# EAGLE schematic schematic_team_xA (EAGLE 8.5.2)
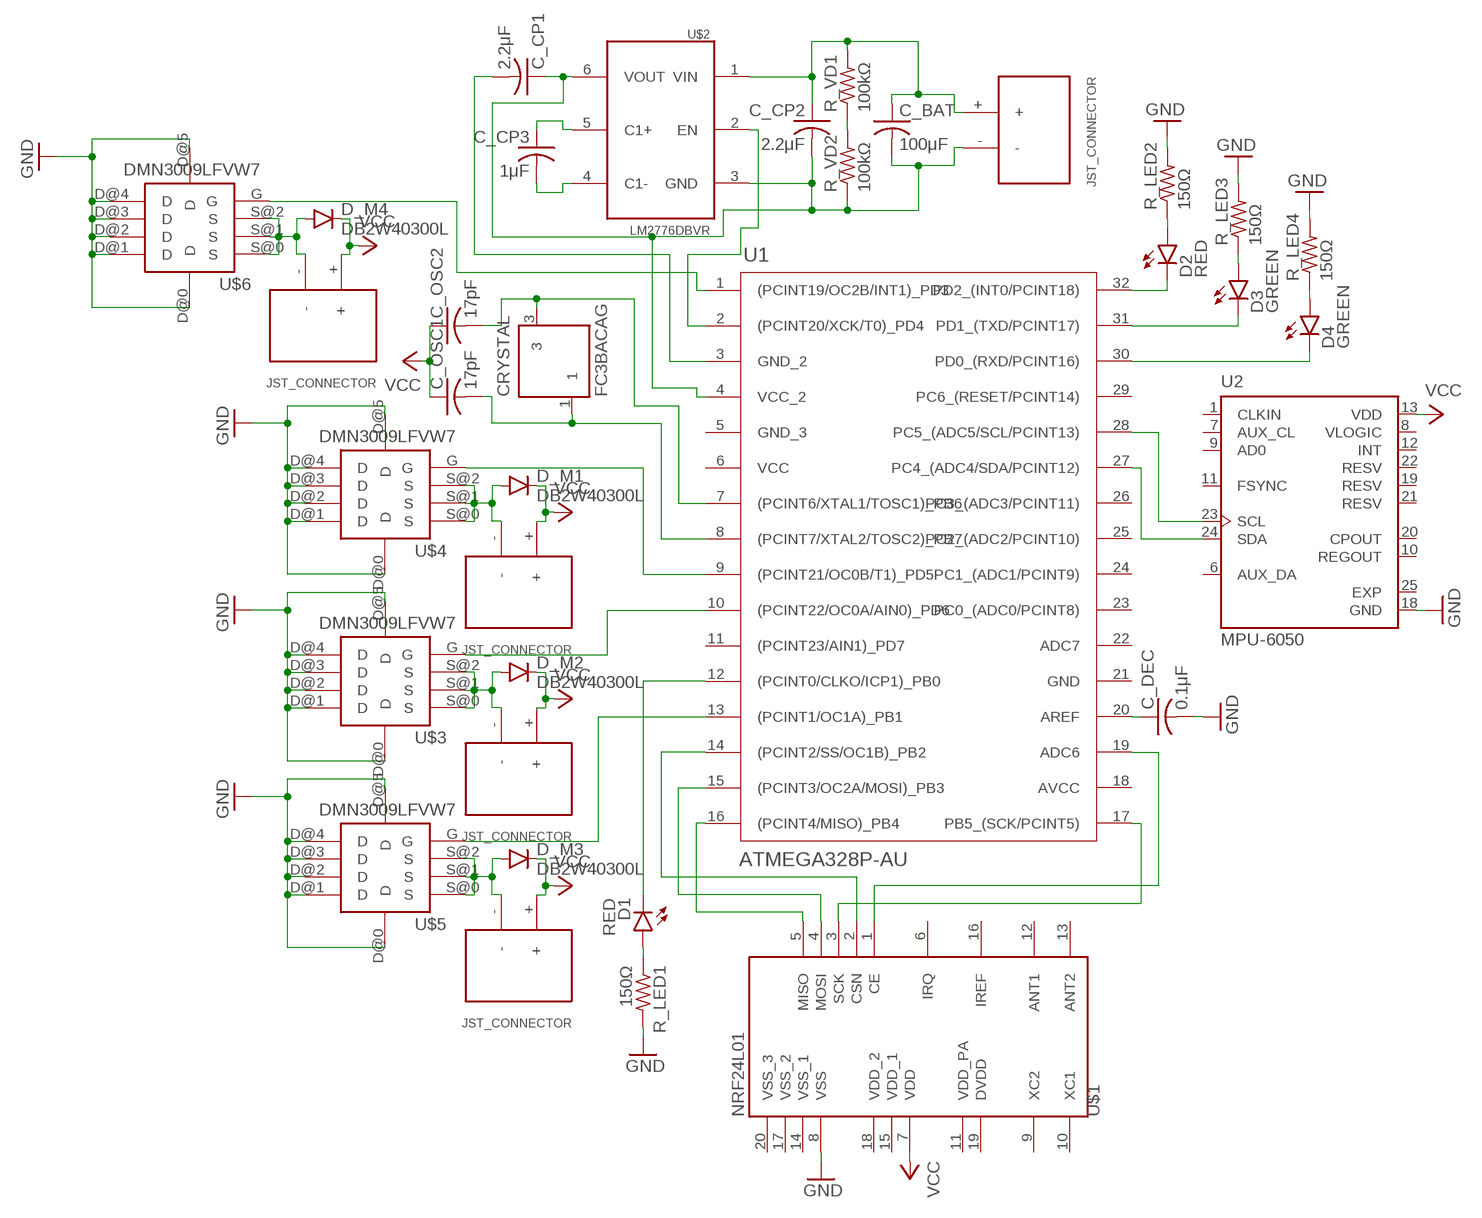
[diagram p0: schematic, sheet 1]

## Parts
C_BAT  100μF  C-USC0805  [C0805]
C_CP1  2.2μF  C-USC0603  [C0603]
C_CP2  2.2μF  C-USC0603  [C0603]
C_CP3  1μF  C-USC0603  [C0603]
C_DEC  0.1μF  C-USC0805  [C0805]
C_OSC1  17pF  C-USC0402  [C0402]
C_OSC2  17pF  C-USC0402  [C0402]
CRYSTAL  FC3BACAG  [SOT23-5]
D1  RED  LED-RED0603  [LED-0603]
D2  RED  LED-RED0603  [LED-0603]
D3  GREEN  LED-GREEN0603  [LED-0603]
D4  GREEN  LED-GREEN0603  [LED-0603]
D_M1  DB2W40300L  [MINI2-F3-B]
D_M2  DB2W40300L  [MINI2-F3-B]
D_M3  DB2W40300L  [MINI2-F3-B]
D_M4  DB2W40300L  [MINI2-F3-B]
MOTOR1  JST_CONNECTOR_FEMALE  [JST_CONNECTOR_FEMALE]
MOTOR2  JST_CONNECTOR_FEMALE  [JST_CONNECTOR_FEMALE]
MOTOR3  JST_CONNECTOR_FEMALE  [JST_CONNECTOR_FEMALE]
MOTOR4  JST_CONNECTOR_FEMALE  [JST_CONNECTOR_FEMALE]
MOTOR5  JST_CONNECTOR_FEMALE  [JST_CONNECTOR_FEMALE]
R_LED1  150Ω  R-US_R0603  [R0603]
R_LED2  150Ω  R-US_R0603  [R0603]
R_LED3  150Ω  R-US_R0603  [R0603]
R_LED4  150Ω  R-US_R0603  [R0603]
R_VD1  100kΩ  R-US_R0603  [R0603]
R_VD2  100kΩ  R-US_R0603  [R0603]
U1  ATMEGA328P-AU  [32A]
U2  MPU-6050  [QFN50P400X400X95-25N]
U$1  NRF24L01  [QFN20]
U$2  LM2776DBVR  [SOT23-5]
U$3  DMN3009LFVW7  [SOT23-5]
U$4  DMN3009LFVW7  [SOT23-5]
U$5  DMN3009LFVW7  [SOT23-5]
U$6  DMN3009LFVW7  [SOT23-5]

## Nets
GND: C_DEC.2 R_LED1.2 R_LED2.2 R_LED3.2 R_LED4.2 U2.18(GND) U$1.8(VSS) U$3.D@0(D) U$3.D@1(D) U$3.D@2(D) U$3.D@3(D) U$3.D@4(D) U$3.D@5(D) U$4.D@0(D) U$4.D@1(D) U$4.D@2(D) U$4.D@3(D) U$4.D@4(D) U$4.D@5(D) U$5.D@0(D) U$5.D@1(D) U$5.D@2(D) U$5.D@3(D) U$5.D@4(D) U$5.D@5(D) U$6.D@0(D) U$6.D@1(D) U$6.D@2(D) U$6.D@3(D) U$6.D@4(D) U$6.D@5(D)
N$1: U1.28(PC5_(ADC5/SCL/PCINT13)) U2.23(SCL)
N$2: C_OSC1.2 CRYSTAL.1 U1.8((PCINT7/XTAL2/TOSC2)_PB7)
N$3: U1.10((PCINT22/OC0A/AIN0)_PD6) U$3.G
N$4: C_DEC.1 U1.20(AREF)
N$5: D_M4.POS(PPIN) MOTOR4.- U$6.S@0(S) U$6.S@1(S) U$6.S@2(S)
N$6: D_M2.POS(PPIN) MOTOR2.- U$3.S@0(S) U$3.S@1(S) U$3.S@2(S)
N$7: U1.27(PC4_(ADC4/SDA/PCINT12)) U2.24(SDA)
N$8: U1.1((PCINT19/OC2B/INT1)_PD3) U$6.G
N$9: C_OSC2.2 CRYSTAL.3 U1.7((PCINT6/XTAL1/TOSC1)_PB6)
N$10: D_M1.POS(PPIN) MOTOR1.- U$4.S@0(S) U$4.S@1(S) U$4.S@2(S)
N$11: D_M3.POS(PPIN) MOTOR3.- U$5.S@0(S) U$5.S@1(S) U$5.S@2(S)
N$12: U1.9((PCINT21/OC0B/T1)_PD5) U$4.G
N$13: U1.19(ADC6) U$1.1(CE)
N$14: C_BAT.1 C_CP2.1 MOTOR5.+ R_VD1.2 U$2.1(VIN)
N$15: U1.14((PCINT2/SS/OC1B)_PB2) U$1.2(CSN)
N$16: U1.13((PCINT1/OC1A)_PB1) U$5.G
N$17: U1.15((PCINT3/OC2A/MOSI)_PB3) U$1.4(MOSI)
N$18: U1.16((PCINT4/MISO)_PB4) U$1.5(MISO)
N$19: U1.17(PB5_(SCK/PCINT5)) U$1.3(SCK)
N$20: C_CP1.2 U1.3(GND_2)
N$21: D1.A R_LED1.1
N$22: D2.A R_LED2.1
N$23: R_VD1.1 R_VD2.2
N$24: D3.A R_LED3.1
N$25: D4.A R_LED4.1
N$26: U1.2((PCINT20/XCK/T0)_PD4) U$2.2(EN)
N$27: D2.C U1.32(PD2_(INT0/PCINT18))
N$28: D3.C U1.31(PD1_(TXD/PCINT17))
N$29: D4.C U1.30(PD0_(RXD/PCINT16))
N$30: C_CP3.1 U$2.5(C1+)
N$31: C_CP3.2 U$2.4(C1-)
N$32: C_BAT.2 C_CP1.1 C_CP2.2 MOTOR5.- R_VD2.1 U1.4(VCC_2) U$2.3(GND) U$2.6(VOUT)
N$34: D1.C U1.12((PCINT0/CLKO/ICP1)_PB0)
VCC: C_OSC1.1 C_OSC2.1 D_M1.NEG(GPIN) D_M2.NEG(GPIN) D_M3.NEG(GPIN) D_M4.NEG(GPIN) MOTOR1.+ MOTOR2.+ MOTOR3.+ MOTOR4.+ U2.13(VDD) U$1.7(VDD)
Unconnected: U1.11((PCINT23/AIN1)_PD7) U1.22(ADC7) U1.23(PC0_(ADC0/PCINT8)) U1.24(PC1_(ADC1/PCINT9)) U1.25(PC2_(ADC2/PCINT10)) U1.26(PC3_(ADC3/PCINT11)) U1.29(PC6_(RESET/PCINT14)) U2.1(CLKIN) U2.6(AUX_DA) U2.7(AUX_CL) U2.9(AD0) U2.10(REGOUT) U2.11(FSYNC) U2.12(INT) U2.19(RESV) U2.20(CPOUT) U2.21(RESV) U2.22(RESV) U$1.6(IRQ) U$1.9(XC2) U$1.10(XC1) U$1.11(VDD_PA) U$1.12(ANT1) U$1.13(ANT2) U$1.14(VSS_1) U$1.15(VDD_1) U$1.16(IREF) U$1.17(VSS_2) U$1.18(VDD_2) U$1.19(DVDD) U$1.20(VSS_3)

## Power pins joined to a net without a drawn wire
AVCC: U1.18(AVCC)
EXP: U2.25(EXP)
GND: U1.21(GND)
GND_3: U1.5(GND_3)
VCC: U1.6(VCC)
VLOGIC: U2.8(VLOGIC)

## Library data of the parts
C_BAT C_DEC = resistor:C-US: CAPACITOR, American symbol
C_CP1-C_CP3 C_OSC1 C_OSC2 = rcl:C-US: CAPACITOR, American symbol
CRYSTAL = FC3BACAG:FC3BACA
D1 D2 = LEDs:LED-RED: Assorted Red LEDs LilyPad 1206- DIO-09912 1206- DIO-00809 0603- DIO-00819 "SMART" means more efficient and expensive; PROD_ID: DIO-00819
D3 D4 = LEDs:LED-GREEN: Various green LEDs Green LEDs used in SFE Production 0603- DIO-00821 LARGE- DIO-00862 LILYPAD- DIO-09910; PROD_ID: DIO-00821
D_M1-D_M4 = quad:DB2W40300L
MOTOR1-MOTOR5 = quad:JST_CONNECTOR_FEMALE
R_LED1-R_LED4 R_VD1 R_VD2 = rcl:R-US_: RESISTOR, American symbol
U1 = ATMEGA328P-AU:ATMEGA328P-AU; MANUFACTURER_PART_NUMBER: ATMEGA328PAU; VENDOR: Atmel
U2 = MPU-6050:MPU-6050: MPU-6050 Six-Axis (Gyro + Accelerometer) MEMS MotionTracking™ Devices; DESCRIPTION: IMU ACCEL/GYRO 3-AXIS I2C 24QFN; DIGI-KEY_PART_NUMBER: 1428-1007-1-ND; DIGI-KEY_PURCHASE_URL: https://www.digikey.com/product-detail/en/tdk-invensense/MPU-6050/1428-1007-1-ND/4038010?WT.z_cid=ref_snapeda&utm_source=snapeda&utm_medium=aggregator&utm_campaign=buynow; MF: TDK; MP: MPU-6050; PACKAGE: QFN-24 InvenSense
U$1 = nrf24l01:NRF24L01: nRF24L01 Single chip 2.4GHz transceiver from Nordic Semiconductors.
U$2 = LM2776:LM2776
U$3-U$6 = DMN3009LFVW:DMN3009LFVW